# EAGLE design CO2Monitor V0.1 (EAGLE 9.6.2)
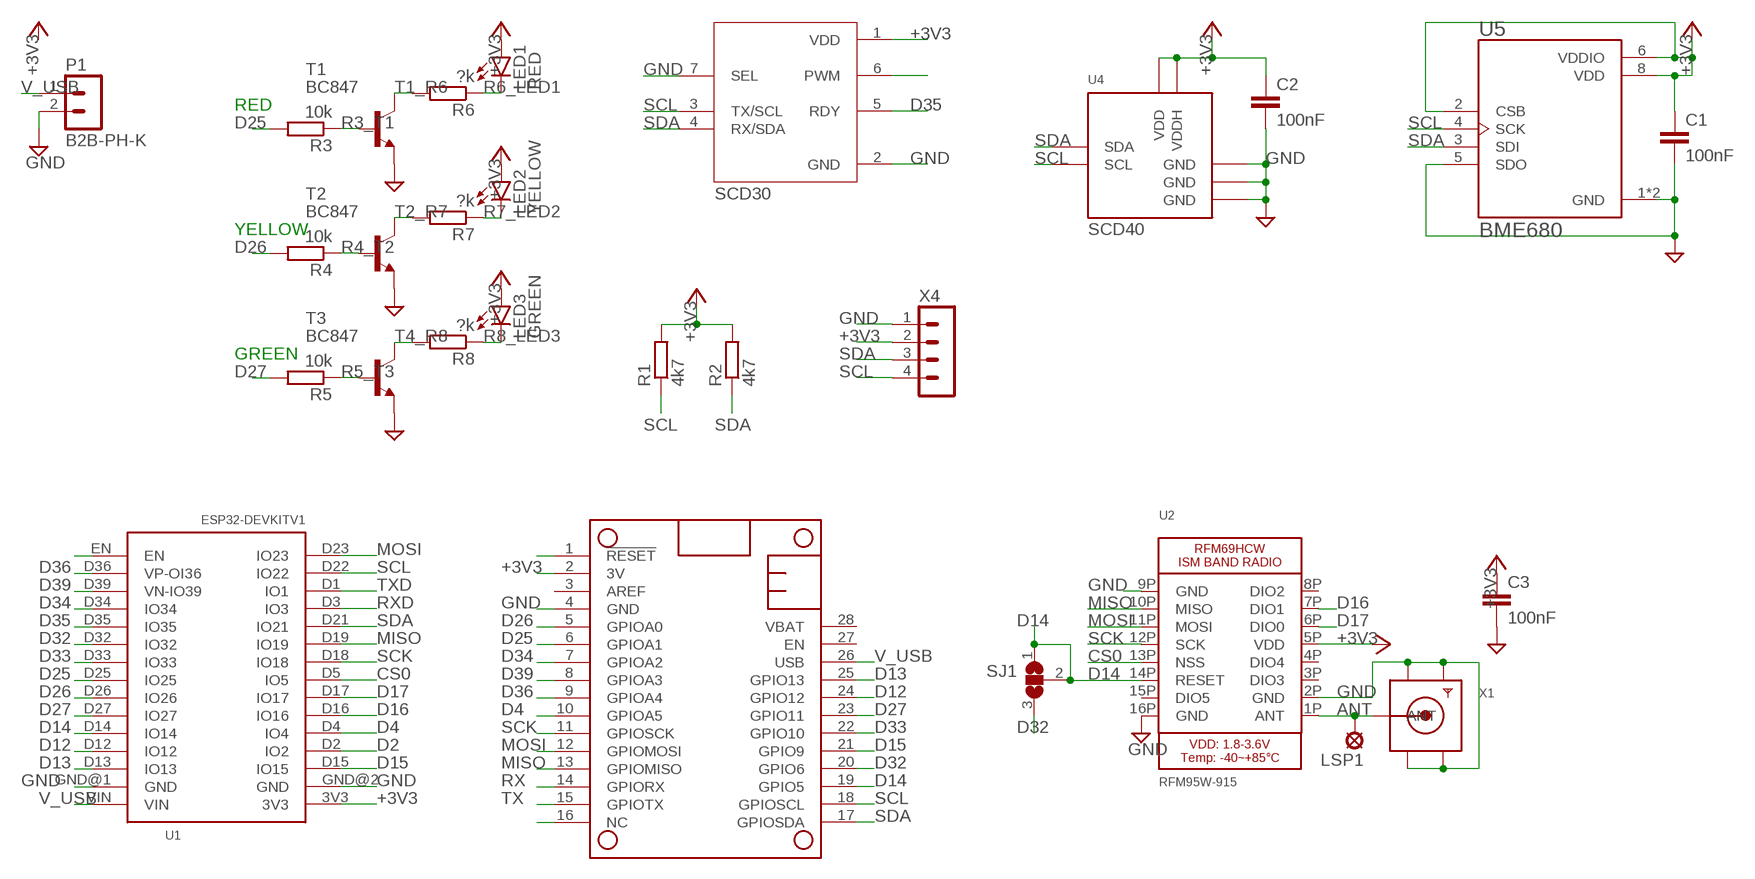
[diagram p0: schematic, sheet 1]

## Parts
C1  100nF  C-EUC0805  [C0805]
C2  100nF  C-EUC0805  [C0805]
C3  100nF  C-EUC0805  [C0805]
LED1  RED  LED5MM  [LED5MM]
LED2  YELLOW  LED5MM  [LED5MM]
LED3  GREEN  LED5MM  [LED5MM]
LSP1  LSP10  [LSP10]
MS1  FEATHERWING_FOOTPRINTFOOTPRINT  [FEATHERWING_FOOTPRINT]
P1  B2B-PH-K  [B2B-PH-K]
R1  4k7  R-EU_R0805  [R0805]
R2  4k7  R-EU_R0805  [R0805]
R3  10k  R-EU_R0805  [R0805]
R4  10k  R-EU_R0805  [R0805]
R5  10k  R-EU_R0805  [R0805]
R6  ?k  R-EU_R0805  [R0805]
R7  ?k  R-EU_R0805  [R0805]
R8  ?k  R-EU_R0805  [R0805]
SJ1  SJ2W  [SJ_2]
T1  BC847  [SOT23]
T2  BC847  [SOT23]
T3  BC847  [SOT23]
U1  ESP32DEVKITV1  [ESP32-DEVKITV1]
U2  RFM95W-915  MICROBUILDER_RFM69HCW_SMT  [MICROBUILDER_RFMHCW_SMT]
U3  SCD30  [MODULE_SCD30]
U4  SCD40  [SCD40]
U5  BME680  [PSON80P300X300X100-8N]
X1  SMACONNECTOR_EDGE_UFL  [SMA_EDGELAUNCH_UFL]
X4  B4B-PH-K  [B4B-PH-K]

## Nets
+3V3: C1.1 C2.1 C3.1 LED1.A LED2.A LED3.A MS1.2(3V) R1.2 R2.2 U1.3V3 U2.5P(VDD) U3.1(VDD) U4.P$7(VDD) U4.P$19(VDDH) U5.2(CSB) U5.6(VDDIO) U5.8(VDD) X4.2
ANT: LSP1.MP U2.1P(ANT) X1.P(ANT)
CS0: U1.D5(IO5) U2.13P(NSS)
D2: U1.D2(IO2)
D4: MS1.10(GPIOA5) U1.D4(IO4)
D12: MS1.24(GPIO12) U1.D12(IO12)
D13: MS1.25(GPIO13) U1.D13(IO13)
D14: MS1.19(GPIO5) SJ1.1 SJ1.2 U1.D14(IO14) U2.14P(RESET)
D15: MS1.21(GPIO9) U1.D15(IO15)
D16: U1.D16(IO16) U2.7P(DIO1)
D17: U1.D17(IO17) U2.6P(DIO0)
D25: MS1.6(GPIOA1) R3.2 U1.D25(IO25)
D26: MS1.5(GPIOA0) R4.2 U1.D26(IO26)
D27: MS1.23(GPIO11) R5.2 U1.D27(IO27)
D32: MS1.20(GPIO6) SJ1.3 U1.D32(IO32)
D33: MS1.22(GPIO10) U1.D33(IO33)
D34: MS1.7(GPIOA2) U1.D34(IO34)
D35: U1.D35(IO35) U3.5(RDY)
D36: MS1.9(GPIOA4) U1.D36(VP-OI36)
D39: MS1.8(GPIOA3) U1.D39(VN-IO39)
GND: C1.2 C2.2 C3.2 MS1.4(GND) P1.2 T1.2(E) T2.2(E) T3.2(E) U1.GND@1(GND) U1.GND@2(GND) U2.2P(GND) U2.9P(GND) U2.16P(GND) U3.2(GND) U3.7(SEL) U4.P$6(GND) U4.P$20(GND) U4.P$21(GND) U5.1(GND) U5.5(SDO) U5.7(GND) X1.GND@1(GND1) X1.GND@2(GND2) X1.GND@3(GND3) X1.GND@4(GND4) X4.1
MISO: MS1.13(GPIOMISO) U1.D19(IO19) U2.10P(MISO)
MOSI: MS1.12(GPIOMOSI) U1.D23(IO23) U2.11P(MOSI)
N$2: U3.6(PWM)
N$3: MS1.16(NC)
N$8: MS1.1(!RESET)
N$17: U1.EN
R3_T1: R3.1 T1.1(B)
R4_T2: R4.1 T2.1(B)
R5_T3: R5.1 T3.1(B)
R6_LED1: LED1.K(C) R6.1
R7_LED2: LED2.K(C) R7.1
R8_LED3: LED3.K(C) R8.1
RX: MS1.14(GPIORX)
RXD: U1.D3(IO3)
SCK: MS1.11(GPIOSCK) U1.D18(IO18) U2.12P(SCK)
SCL: MS1.18(GPIOSCL) R1.1 U1.D22(IO22) U3.3(TX/SCL) U4.P$9(SCL) U5.4(SCK) X4.4
SDA: MS1.17(GPIOSDA) R2.1 U1.D21(IO21) U3.4(RX/SDA) U4.P$10(SDA) U5.3(SDI) X4.3
T1_R6: R6.2 T1.3(C)
T2_R7: R7.2 T2.3(C)
T4_R8: R8.2 T3.3(C)
TX: MS1.15(GPIOTX)
TXD: U1.D1(IO1)
V_USB: MS1.26(USB) P1.1 U1.VIN
Unconnected: MS1.3(AREF) MS1.27(EN) MS1.28(VBAT) U2.3P(DIO3) U2.4P(DIO4) U2.8P(DIO2) U2.15P(DIO5)

## Notes on the sheet
- RED
- YELLOW
- GREEN

## Library data of the parts
C1-C3 = rcl:C-EU: CAPACITOR, European symbol; SPICEPREFIX: C
LED1-LED3 = led:LED: LED OSRAM: - CHIPLED LG R971, LG N971, LY N971, LG Q971, LY Q971, LO R971, LY R971 LH N974, LH R974 LS Q976, LO Q976, LY Q976 LO Q996 - Hyper CHIPLED LW Q18S LB Q993, LB Q99A, LB R99A - SideLED LS A670, LO A670, LY A670, LG A670, LP A670 LB A673, LV A673, LT A673, LW A673 LH A674 LY A675 LS A676, LA A676, LO A676, LY A676, LW A676 LS A679, LY A679, LG A679 - Hyper Micro SIDELED® LS Y876, LA Y876, LO Y876, LY Y876 LT Y87S - SmartLED LW L88C, LW L88S LB L89C, LB L89S, LG L890 LS L89K, LO L89K, LY L89K LS L896, LA L896, LO L896, LY L896 - TOPLED LS T670, LO T670, LY T670, LG T670, LP T670 LSG T670, LSP T670, LSY T670, LOP T670, LYG T670 LG T671, LOG T671, LSG T671 LB T673, LV T673, LT T673, LW T673 LH T674 LS T676, LA T676, LO T676, LY T676, LB T676, LH T676, LSB T676, LW T676 LB T67C, LV T67C, LT T67C, LS T67K, LO T67K, LY T67K, LW E67C LS E67B, LA E67B, LO E67B, LY E67B, LB E67C, LV E67C, LT E67C LW T67C LS T679, LY T679, LG T679 LS T770, LO T770, LY T770, LG T770, LP T770 LB T773, LV T773, LT T773, LW T773 LH T774 LS E675, LA E675, LY E675, LS T675 LS T776, LA T776, LO T776, LY T776, LB T776 LHGB T686 LT T68C, LB T68C - Hyper Mini TOPLED® LB M676 - Mini TOPLED Santana® LG M470 LS M47K, LO M47K, LY M47K Source: http://www.osram.convergy.de LUXEON: - LUMILED® LXK2-PW12-R00, LXK2-PW12-S00, LXK2-PW14-U00, LXK2-PW14-V00 LXK2-PM12-R00, LXK2-PM12-S00, LXK2-PM14-U00 LXK2-PE12-Q00, LXK2-PE12-R00, LXK2-PE12-S00, LXK2-PE14-T00, LXK2-PE14-U00 LXK2-PB12-K00, LXK2-PB12-L00, LXK2-PB12-M00, LXK2-PB14-N00, LXK2-PB14-P00, LXK2-PB14-Q00 LXK2-PR12-L00, LXK2-PR12-M00, LXK2-PR14-Q00, LXK2-PR14-R00 LXK2-PD12-Q00, LXK2-PD12-R00, LXK2-PD12-S00 LXK2-PH12-R00, LXK2-PH12-S00 LXK2-PL12-P00, LXK2-PL12-Q00, LXK2-PL12-R00 Source: www.luxeon.com KINGBRIGHT: KA-3528ASYC Source: www.kingbright.com
LSP1 = solpad:LSP10: SOLDER PAD drill 1.0 mm, distributor Buerklin, 12H555
MS1 = FeatherWing:FEATHERWING_FOOTPRINT
P1 = con-jst-ph:B2B-PH-K: HEADER
R1-R8 = rcl:R-EU_: RESISTOR, European symbol; SPICEPREFIX: R
SJ1 = jumper:SJ2W: SMD solder JUMPER
T1-T3 = transistor:BC847: NPN TRANSISTOR
U1 = ESP32-DEVKITV1:ESP32DEVKITV1
U2 = Adafruit RFM+LoRa Breakout:MICROBUILDER_RFM69HCW: RFM69HCW - ISM Band RF Transceiver
U3 = SCD30:SCD30: SCD30 Series 5.5 V 75 mA ±3% Carbon Dioxide (CO2) Sensor Module Check prices <https://pricing.snapeda.com/parts/SCD30/Sensirion%20AG/view-part?ref=eda>; AVAILABILITY: In Stock; DESCRIPTION: Carbon Dioxide (CO2) Sensor I²C, Modbus, PWM; MF: Sensirion AG; MP: SCD30; PACKAGE: None; PRICE: None; PURCHASE-URL: https://pricing.snapeda.com/search/part/SCD30/?ref=eda
U4 = SCD40:SCD40
U5 = BME680:BME680: Integrated Environmental Unit Check prices <https://pricing.snapeda.com/parts/BME680/Bosch%20Sensortec/view-part?ref=eda>; AVAILABILITY: In Stock; DESCRIPTION: Gas, Humidity, Pressure, Temperature Sensor I²C, SPI Output; MF: Bosch Sensortec; MP: BME680; PACKAGE: LGA-8 Bosch Tools; PRICE: None; PURCHASE-URL: https://pricing.snapeda.com/search/part/BME680/?ref=eda
X1 = adafruit:SMACONNECTOR: SMA Connector 90° DIP SMA Connector, 50 Ohm (4UConnector: 07259)
X4 = con-jst-ph:B4B-PH-K: HEADER

## Board
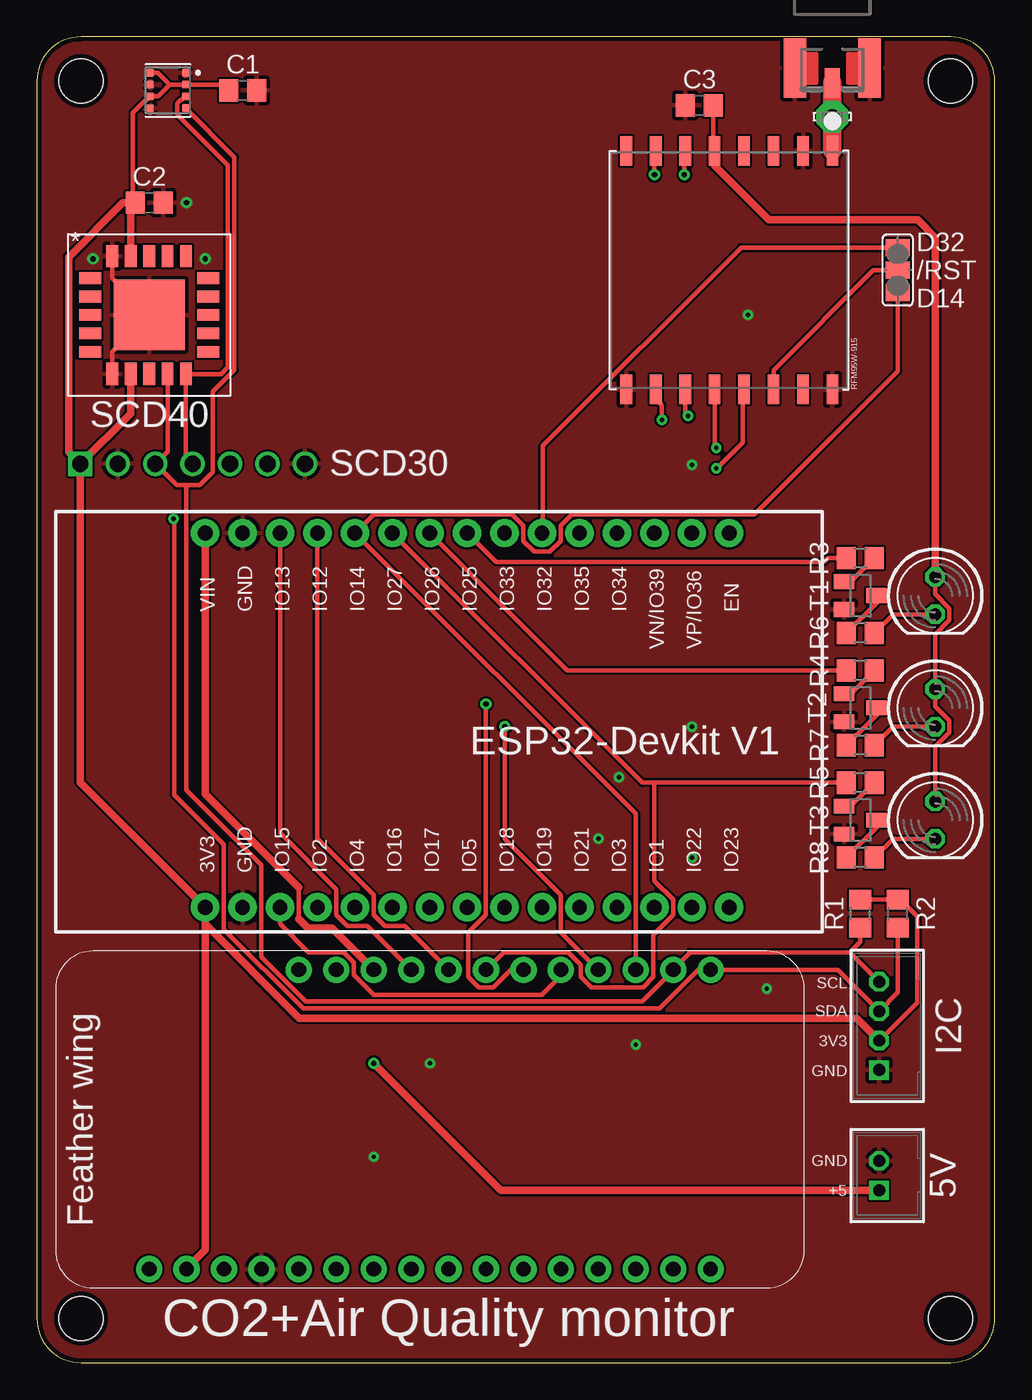
[diagram p1: board, top side]
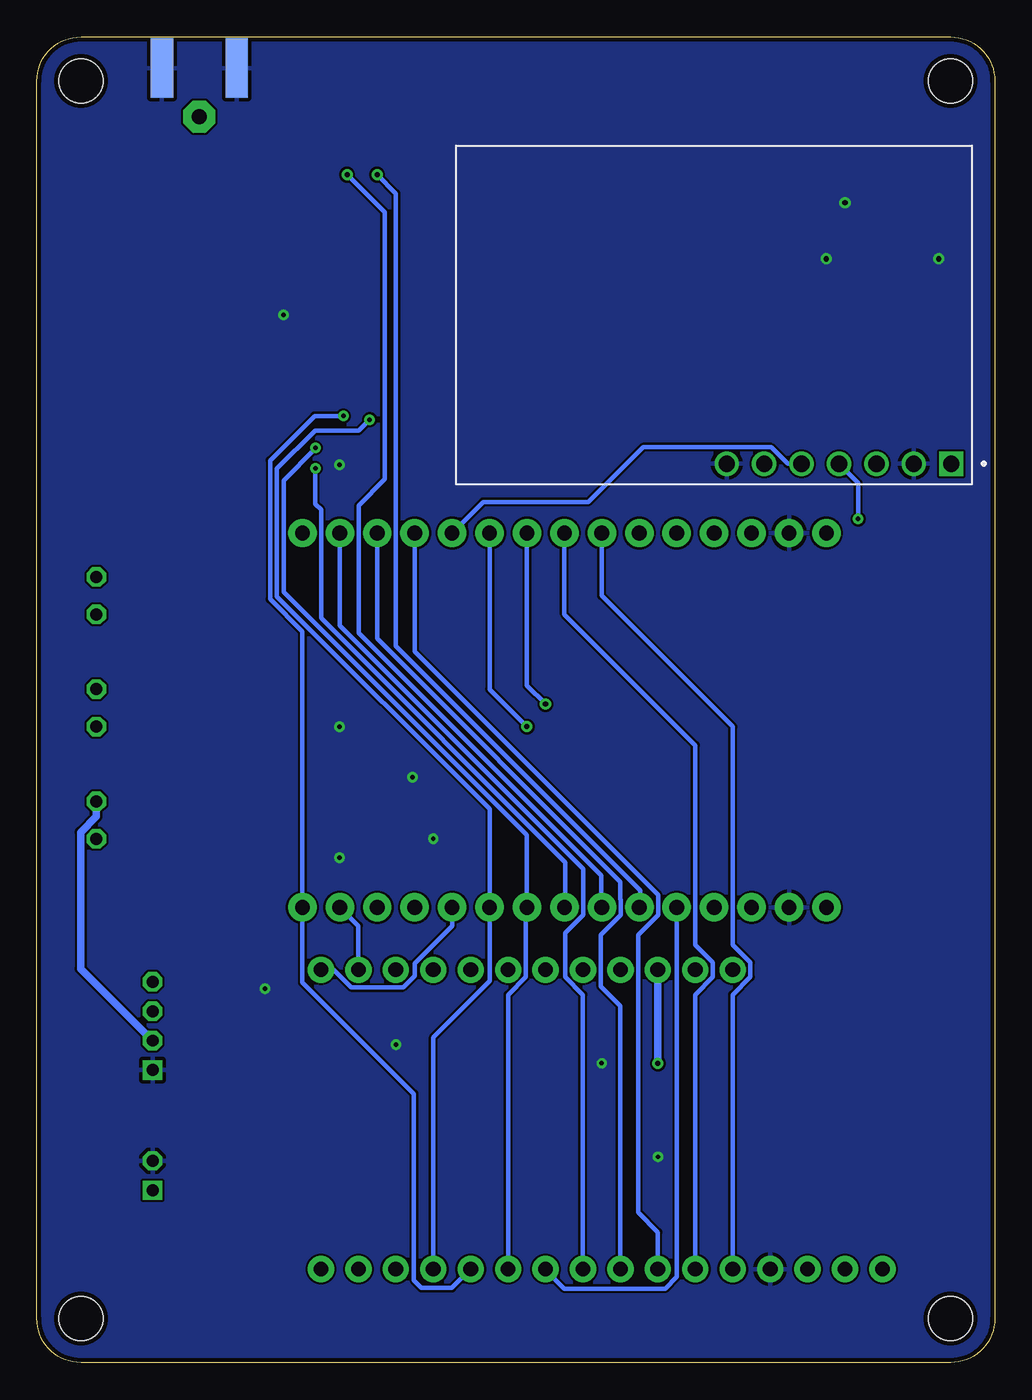
[diagram p2: board, bottom side, seen from below]

Size 65 x 90 mm. Coordinates in mm from the lower left corner, seen from the top.
Outline: 62,90 3,90 arc90 0,87 0,3 arc90 3,0 62,0 arc90 65,3 65,87 arc90 62,90
Copper layers (1*16): Top 0.035mm / dielectric 1.5mm / Bottom 0.035mm
Design rules "Seeed": minimum track width 6mil, minimum drill 0.3mm, track to track 6mil, track to pad 6mil, pad to pad 6mil, via to via 12mil, smd to smd 6mil, copper to edge 12mil, drill to drill 6mil, minimum pad ring 10mil, minimum via ring 8mil, stop-mask expansion 4mil, vias tented up to drill 20mil, thermal gap 10mil
Holes 3 mm at 3,3 62,3 62,87 3,87

### Footprints (pad centres in the part's own frame; a part is rotated, then mirrored left to right if it is on the bottom)
C0805 = smd 1.3 x 1.5: 1 -0.95,0; 2 0.95,0
LED5MM = drill 0.813 octagon: A -1.27,0; K 1.27,0
LSP10 = drill 1.016 pad 2.159 octagon: MP 0,0
FEATHERWING_FOOTPRINT = drill 1 pad 1.778: 1 6.35,1.27; 2 8.89,1.27; 3 11.43,1.27; 4 13.97,1.27; 5 16.51,1.27; 6 19.05,1.27; 7 21.59,1.27; 8 24.13,1.27; 9 26.67,1.27; 10 29.21,1.27; 11 31.75,1.27; 12 34.29,1.27; 13 36.83,1.27; 14 39.37,1.27; 15 41.91,1.27; 16 44.45,1.27; 17 44.45,21.59; 18 41.91,21.59; 19 39.37,21.59; 20 36.83,21.59; 21 34.29,21.59; 22 31.75,21.59; 23 29.21,21.59; 24 26.67,21.59; 25 24.13,21.59; 26 21.59,21.59; 27 19.05,21.59; 28 16.51,21.59
B2B-PH-K = drill 0.813 square: 1 -1,0 | drill 0.813 octagon: 2 1,0
R0805 = smd 1.3 x 1.5: 1 -0.95,0; 2 0.95,0
SJ_2 = smd 1.168 x 1.6: 1 -1.524,0; 2 0,0; 3 1.524,0
SOT23 = smd 1 x 1.4: 1 -0.95,-1.1; 2 0.95,-1.1; 3 0,1.1
ESP32-DEVKITV1 = drill 1 pad 1.93: 3V3 -16.52,-12.27; D1 13.96,-12.27; D2 -8.9,-12.27; D3 11.42,-12.27; D4 -6.36,-12.27; D5 1.26,-12.27; D12 -8.9,13.135; D13 -11.44,13.135; D14 -6.36,13.135; D15 -11.44,-12.27; D16 -3.82,-12.27; D17 -1.28,-12.27; D18 3.8,-12.27; D19 6.34,-12.27; D21 8.88,-12.27; D22 16.5,-12.27; D23 19.04,-12.27; D25 1.26,13.135; D26 -1.28,13.135; D27 -3.82,13.135; D32 6.34,13.135; D33 3.8,13.135; D34 11.42,13.135; D35 8.88,13.135; D36 16.5,13.135; D39 13.96,13.135; EN 19.04,13.135; GND@1 -13.98,13.135; GND@2 -13.98,-12.27; VIN -16.52,13.135
MICROBUILDER_RFMHCW_SMT = smd 2 x 0.8: 1P 8.1,-7; 2P 8.1,-5; 3P 8.1,-3; 4P 8.1,-1; 5P 8.1,1; 6P 8.1,3; 7P 8.1,5; 8P 8.1,7; 9P -8.1,7; 10P -8.1,5; 11P -8.1,3; 12P -8.1,1; 13P -8.1,-1; 14P -8.1,-3; 15P -8.1,-5; 16P -8.1,-7
MODULE_SCD30 = drill 1.1 square: 1 -16.1,10.1 | drill 1.1: 2 -13.56,10.1; 3 -11.02,10.1; 4 -8.48,10.1; 5 -5.94,10.1; 6 -3.4,10.1; 7 -0.86,10.1
SCD40 = smd 1.5 x 0.8: P$1 -4,2.5; P$2 -4,1.25; P$3 -4,0; P$4 -4,-1.25; P$5 -4,-2.5; P$11 4,-2.5; P$12 4,-1.25; P$13 4,0; P$14 4,1.25; P$15 4,2.5 | smd 0.8 x 1.5: P$6 -2.5,-4; P$7 -1.25,-4; P$8 0,-4; P$9 1.25,-4; P$10 2.5,-4; P$16 2.5,4; P$17 1.25,4; P$18 0,4; P$19 -1.25,4; P$20 -2.5,4 | smd 4.8 x 4.8: P$21 0,0
PSON80P300X300X100-8N = smd 0.5 x 0.5: 1 1.2,1.2; 2 1.2,0.4; 3 1.2,-0.4; 4 1.2,-1.2; 5 -1.2,-1.22; 6 -1.2,-0.4; 7 -1.2,0.4; 8 -1.2,1.2
SMA_EDGELAUNCH_UFL = smd 4.064 x 1.524: GND@1 2.032,-2.54; GND@2 2.032,2.54 | smd 4.064 x 1.524 bottom: GND@3 2.032,2.54; GND@4 2.032,-2.54 | smd 2.032 x 1.016: P 3.048,0
B4B-PH-K = drill 0.813 square: 1 -3,0 | drill 0.813 octagon: 2 -1,0; 3 1,0; 4 3,0

### Placement (x,y rotation side)
C1  13.97,86.36 0 top
C2  7.62,78.74 0 top
C3  44.96,85.34 180 top
LED1  60.96,52.07 270 top
LED2  60.96,44.45 270 top
LED3  60.96,36.83 270 top
LSP1  53.98,84.58 0 top
MS1  1.27,5.08 0 top
P1  57.15,12.7 90 top
R1  55.88,30.48 90 top
R2  58.42,30.48 90 top
R3  55.88,54.61 180 top
R4  55.88,46.99 180 top
R5  55.88,39.37 180 top
R6  55.88,49.53 180 top
R7  55.88,41.91 180 top
R8  55.88,34.29 180 top
SJ1  58.42,74.17 90 top
T1  55.88,52.07 270 top
T2  55.88,44.45 270 top
T3  55.88,36.83 270 top
U1  27.94,43.18 0 top
U2  46.99,74.17 90 top
U3  19.05,71.12 180 bottom
U4  7.62,71.12 0 top
U5  8.89,86.36 0 top
X1  53.98,89.92 270 top
X4  57.15,22.86 90 top

### Tracks (layer width: path | path; a pad name or v marks a point on that pad's centre or on a via)
+3V3
  Top 0.305: LED3.A 60.96,41.81 61.92,42.78 61.92,43.58 60.96,44.55 LED2.A 60.96,49.44 61.92,50.4 61.92,51.2 60.96,52.16 LED1.A | C3.1 45.91,82.35 U2.5P | C2.1 6.51,78.58 6.51,84.85 7.35,85.69 7.42,85.69 U5.6 8.24,85.96 9.02,86.74 | U5.8 8.2,87.56 9.02,86.74 | 9.02,86.74 10.07,86.74 U5.2 12.62,86.76 C1.1 | R1.2 R2.2 58.6,31.43 59.73,30.31 59.73,24.44 X4.2
  Top 0.508: MS1.2 10.16,6.41 11.42,7.67 U1.3V3 | U4.P$19 6.37,78.44 6.51,78.58 | C2.1 5.84,78.74 2.16,75.06 2.16,61.81 U3.1 | U3.1 6.37,64.44 U4.P$7 | U1.3V3 2.95,39.38 U3.1 | U1.3V3 11.42,29.77 17.8,23.38 55.63,23.38 X4.2 | U2.5P 45.99,81.25 49.67,77.57 59.77,77.57 60.96,76.38 LED1.A
  Bottom 0.508: LED3.A 60.96,37.07 62.03,36 62.03,26.74 X4.2
ANT
  Top 1.27: U2.1P 53.98,82.28 LSP1.MP X1.P
CS0  (via drill 0.3)
  Top 0.305: v46.1,60.71 46.14,60.71 47.9,62.47 47.9,65.98 U2.13P
  Bottom 0.305: U1.D5 29.13,30.98 29.13,33.97 45.71,50.55 45.71,57.9 46.1,58.29 v46.1,60.71
D4
  Bottom 0.305: U1.D4 21.58,5.82 22.37,5.03 29.2,5.03 30.48,6.31 MS1.10
D12
  Top 0.305: U1.D12 19.04,35.57 22.85,31.76 22.85,30.38 23.59,29.64 24.97,29.64 MS1.24
D13
  Top 0.305: U1.D13 16.5,35.95 20.31,32.14 20.31,30.38 21.05,29.64 22.43,29.64 MS1.25
D14
  Top 0.305: MS1.19 40.64,30.37 40.63,30.38 40.63,37.27 U1.D14 22.85,57.59 32.27,57.59 33.01,56.84 33.01,55.79 33.75,55.05 34.81,55.05 35.55,55.79 35.55,56.84 36.29,57.59 48.7,57.59 58.42,67.31 SJ1.1 SJ1.2 56.77,74.17 49.99,67.39 U2.14P
D15
  Top 0.305: U1.D15 16.5,29.77 18.4,27.86 20.81,27.86 21.51,27.16 21.51,26.33 22.87,24.97 34.28,24.97 35.56,26.25 MS1.21
D16  (via drill 0.35)
  Top 0.305: v41.91,80.64 41.91,82.19 U2.7P
  Bottom 0.305: U1.D16 24.05,30.98 24.05,32.07 40.63,48.64 40.63,79.36 v41.91,80.64
D17  (via drill 0.35)
  Top 0.305: v43.94,80.64 43.94,82.22 U2.6P
  Bottom 0.305: U1.D17 26.71,30.96 26.71,33.07 43.17,49.53 43.17,58.18 41.38,59.97 41.38,78.08 v43.94,80.64
D25
  Top 0.305: R3.2 53.66,54.61 53.41,54.36 31.16,54.36 U1.D25
  Bottom 0.305: MS1.6 20.32,24.98 19.13,26.18 19.13,27.16 20.31,28.35 20.31,41.9 29.21,50.8 U1.D25
D26
  Top 0.305: R4.2 35.98,46.99 U1.D26
  Bottom 0.305: MS1.5 17.78,24.98 16.59,26.18 16.59,27.16 17.77,28.35 17.77,43.17 26.67,52.07 U1.D26
D27
  Top 0.305: R5.2 41.91,39.37 | 41.91,39.37 41.06,39.37 U1.D27 | MS1.23 31.67,27.86 36.05,27.86 36.91,27.01 36.91,26.18 37.61,25.48 41.13,25.48 41.83,26.18 41.83,29.05 43.17,30.38 43.17,31.44 41.91,32.7 41.91,39.37
D32  (via drill 0.35)
  Top 0.305: MS1.20 35.55,29.22 35.55,31.44 35.56,31.45 35.56,31.75 31.75,35.56 v31.75,43.18 | U1.D32 34.33,56.37 34.33,62.24 47.78,75.69 SJ1.3
  Bottom 0.305: U1.D32 34.28,45.71 v31.75,43.18
D33  (via drill 0.35)
  Top 0.305: MS1.22 32.17,26.67 30.97,25.48 29.99,25.48 29.29,26.18 29.29,29.2 30.47,30.38 v30.47,44.69 v30.48,44.7
  Bottom 0.305: U1.D33 31.74,45.96 v30.48,44.7
D34
  Bottom 0.305: MS1.7 22.86,8.85 24.21,10.2 24.21,29.03 22.85,30.38 22.85,31.74 39.37,48.26 U1.D34
D35
  Bottom 0.305: U1.D35 34.72,58.42 27.59,58.42 23.86,62.15 15.18,62.15 14.05,61.02 U3.5
D36
  Bottom 0.305: MS1.9 27.94,24.98 29.13,26.18 29.13,29.18 27.93,30.38 27.93,33.52 44.44,50.03 U1.D36
D39
  Bottom 0.305: MS1.8 25.4,24.22 26.72,25.54 26.72,29.05 25.39,30.38 25.39,31.44 25.4,31.45 25.4,32.64 41.91,49.15 U1.D39
GND  (via drill 0.3, 0.35)
  Top 0.305: U4.P$6 5.12,68.62 U4.P$21 5.12,73.62 U4.P$20
  other vias: 22.86,13.97 26.67,20.32 40.64,21.59 49.53,25.4 38.1,35.56 44.45,34.29 44.45,43.18 3.81,74.93 44.45,60.96 48.26,71.12 39.5,39.75 11.43,74.93 10.16,78.74
  pour Top: -1.27,-2.54 72.39,-2.54 72.39,91.44 -1.27,91.44
  pour Bottom: -3.81,-5.08 73.66,-5.08 73.66,92.71 -3.81,92.71
MISO  (via drill 0.3)
  Top 0.305: U2.10P 41.99,65.43 42.42,65 v42.42,64.01
  Bottom 0.305: MS1.13 38.1,22.1 34.28,25.92 U1.D19 34.28,37.58 48.71,52.01 48.71,60.68 46.12,63.27 43.16,63.27 v42.42,64.01
MOSI  (via drill 0.3)
  Top 0.305: v44.2,64.26 43.99,64.47 U2.11P
  Bottom 0.305: MS1.12 36.83,5.08 38.9,5.08 39.42,5.6 39.42,18.25 46.98,25.81 U1.D23 46.98,49.63 49.16,51.82 49.16,61.25 46.15,64.26 v44.2,64.26
R3_T1
  Top 0.305: T1.1 55.24,53.02 R3.1
R4_T2
  Top 0.305: T2.1 55.24,45.4 R4.1
R5_T3
  Top 0.305: T3.1 55.24,37.78 R5.1
R6_LED1
  Top 0.305: R6.1 58.1,50.8 LED1.K
R7_LED2
  Top 0.305: R7.1 58.1,43.18 LED2.K
R8_LED3
  Top 0.305: R8.1 58.1,35.56 LED3.K
SCK  (via drill 0.3)
  Top 0.305: U2.12P 45.99,62.21 v46.1,62.1
  Bottom 0.305: MS1.11 33.02,24.98 31.83,26.18 31.83,30.82 U1.D18 31.75,35.81 48.25,52.31 48.25,59.89 46.1,62.04 v46.1,62.1
SCL
  Top 0.305: U4.P$9 8.87,61.86 U3.3 9.49,59.56 10.15,59.56 | U5.4 13.41,81.84 13.41,67.38 11.94,65.9 11.94,60.45 11.05,59.56 10.15,59.56 | 55.16,27.85 55.15,27.86 44.34,27.86 43.18,26.71 MS1.18 43.18,26.62 41.07,24.51 18.25,24.51 15.23,27.53 15.23,33.78 10.15,38.86 10.15,59.56 | 55.16,27.85 X4.4 | R1.1 55.88,28.57 55.16,27.85
  Bottom 0.305: MS1.18 43.18,29.65 U1.D22
SDA  (via drill 0.3)
  Top 0.305: U3.4 10.12,61.47 U4.P$10 12.51,67.12 12.95,67.56 12.95,81.28 9.54,84.7 9.54,85.5 9.75,85.72 9.85,85.72 U5.3 | R2.1 58.42,25.13 X4.3 54.34,26.67 MS1.17 44.87,26.67 42.25,24.05 18.06,24.05 12.69,29.43 12.69,35.17 9.31,38.54 9.31,57.24 v9.27,57.28
  Bottom 0.305: MS1.17 44.87,26.67 43.67,25.48 40.15,25.48 39.37,26.25 39.37,27.09 36.82,29.64 U1.D21 | v9.27,57.28 9.27,59.72 U3.4
T1_R6
  Top 0.305: R6.2 56.98,51.58 T1.3
T2_R7
  Top 0.305: R7.2 56.98,43.96 T2.3
T4_R8
  Top 0.305: R8.2 56.98,36.34 T3.3
V_USB  (via drill 0.35)
  Top 0.305: 17.77,30.13 17.77,32.27
  Top 0.508: U1.VIN 11.42,38.62 17.77,32.27 | 17.77,30.13 18.39,29.51 20.02,29.51 MS1.26 | v22.86,20.32 31.48,11.7 P1.1
  Bottom 0.508: MS1.26 v22.86,20.32

### Text on the board
tNames: D32 | /RST | D14 | SCD40 | SCD30 | SCL | SDA | I2C | 3V3 | GND | Feather wing | GND | 5V | +5 | CO2+Air Quality monitor